# Altium schematic sheet MagnetometerBreakoutSCH.SchDoc
size A; SheetNumber: 1; SheetTotal: 1
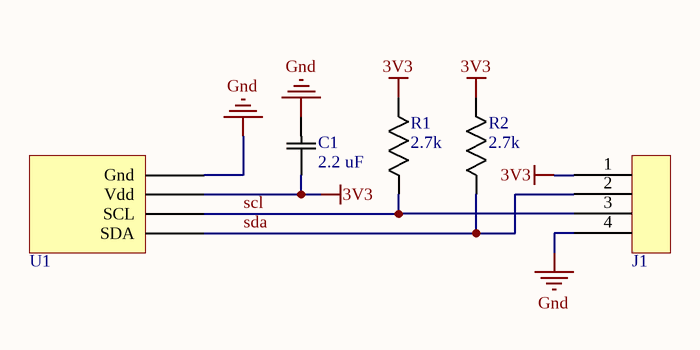
[diagram p0: MagnetometerBreakoutSCH.SchDoc]

## Parts
C1  value 2.2 uF  [CAP 0603]  (hidden comment: CL10A225KP8NNNC)
J1  Header 0.1" 4P  [0.1" Header 4P]  (value not drawn)
R1  value 2.7k  [RES 0805]  (hidden comment: RC0805JR-072K7L)
R2  value 2.7k  [RES 0805]  (hidden comment: RC0805JR-072K7L)
U1  MMC5603NJ  [4-WLP]  (value not drawn)

## Nets
3V3: C1.2 J1.1 R1.2 R2.1 U1.B1(Vdd)
Gnd: C1.1 J1.4 U1.A1(Gnd)
scl: J1.3 R1.1 U1.A2(SCL)
sda: J1.2 R2.2 U1.B2(SDA)

## Library data of the parts
C1 = CL10A225KP8NNNC: CAP CER 2.2UF 10V X5R 0603; Mfr_Name: Samsung; Type: DEV; Copyright: Copyright (C) 2022 Ultra Librarian. All rights reserved.; Manufacturer_Part_Number: CL10A225KP8NNNC; Digi-Key_Part_Number_1: 1276-1085-2-ND; Digi-Key_Part_Number_2: 1276-1085-1-ND; Digi-Key_Part_Number_3: 1276-1085-6-ND; RefDes: RefDes
J1 = Header 0.1" 4P: CONN SIL HDR MALE PIN
R1 R2 = RC0805JR-072K7L: No Description Available; Mfr_Name: Yageo; Copyright: Copyright (C) 2022 Ultra Librarian. All rights reserved.; Manufacturer_Part_Number: RC0805JR-072K7L; Digi-Key_Part_Number_1: 311-2.7KARCT-ND; Digi-Key_Part_Number_2: 311-2.7KARDKR-ND; Digi-Key_Part_Number_3: 311-2.7KARTR-ND; RefDes: RefDes; Type: DEV
U1 = MMC5603NJ: 3-AXIS AMR MAGNETIC SENSOR; Supplier 1: Digi-Key; Supplier 2: Digi-Key; Supplier 3: Digi-Key; Supplier 4: Mouser; Supplier Part Number 1: 1267-MMC5603NJCT-ND; Supplier Part Number 2: 1267-MMC5603NJDKR-ND; Supplier Part Number 3: 1267-MMC5603NJTR-ND; Supplier Part Number 4: 438-MMC5603NJ